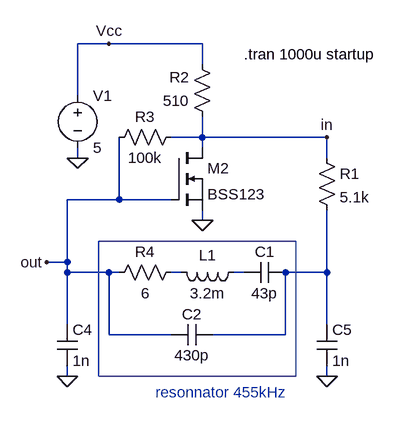
[diagram p0: schematic osc_LC2.asc]
osc_LC2.asc, the LTspice schematic file:
Version 4
SHEET 1 1732 684
WIRE 832 -320 784 -320
WIRE 976 -320 832 -320
WIRE 976 -288 976 -320
WIRE 784 -240 784 -320
WIRE 976 -176 976 -208
WIRE 976 -176 928 -176
WIRE 1168 -176 976 -176
WIRE 976 -160 976 -176
WIRE 784 -144 784 -160
WIRE 1168 -144 1168 -176
WIRE 848 -80 848 -176
WIRE 848 -80 768 -80
WIRE 928 -80 848 -80
WIRE 976 -48 976 -64
WIRE 768 16 768 -80
WIRE 768 16 736 16
WIRE 768 32 768 16
WIRE 832 32 768 32
WIRE 848 32 832 32
WIRE 944 32 928 32
WIRE 1040 32 1024 32
WIRE 1168 32 1168 -64
WIRE 1168 32 1104 32
WIRE 768 112 768 32
WIRE 1168 112 1168 32
WIRE 832 128 832 32
WIRE 928 128 832 128
WIRE 1104 128 1104 32
WIRE 1104 128 992 128
WIRE 768 192 768 176
WIRE 1168 192 1168 176
FLAG 736 16 out
FLAG 768 192 0
FLAG 1168 192 0
FLAG 1168 -176 in
FLAG 784 -144 0
FLAG 832 -320 Vcc
FLAG 976 -48 0
SYMBOL cap 752 112 R0
SYMATTR InstName C4
SYMATTR Value 1n
SYMBOL cap 1152 112 R0
SYMATTR InstName C5
SYMATTR Value 1n
SYMBOL res 992 -192 R180
WINDOW 0 36 76 Left 0
WINDOW 3 36 40 Left 0
SYMATTR InstName R2
SYMATTR Value 510
SYMBOL voltage 784 -256 R0
WINDOW 123 0 0 Left 0
WINDOW 39 0 0 Left 0
SYMATTR InstName V1
SYMATTR Value 5
SYMBOL nmos 928 -160 R0
SYMATTR InstName M2
SYMATTR Value BSS123
SYMBOL ind 1040 16 R90
WINDOW 0 5 56 VBottom 0
WINDOW 3 32 56 VTop 0
SYMATTR InstName L1
SYMATTR Value 3.2m
SYMBOL res 1152 -160 R0
SYMATTR InstName R1
SYMATTR Value 5.1k
SYMBOL cap 1104 16 R90
WINDOW 0 0 32 VBottom 0
WINDOW 3 32 32 VTop 0
SYMATTR InstName C1
SYMATTR Value 43p
SYMBOL res 944 -192 R90
WINDOW 0 0 56 VBottom 0
WINDOW 3 32 56 VTop 0
SYMATTR InstName R3
SYMATTR Value 100k
SYMBOL res 944 16 R90
WINDOW 0 0 56 VBottom 0
WINDOW 3 32 56 VTop 0
SYMATTR InstName R4
SYMATTR Value 6
SYMBOL cap 992 112 R90
WINDOW 0 0 32 VBottom 0
WINDOW 3 32 32 VTop 0
SYMATTR InstName C2
SYMATTR Value 430p
TEXT 1040 -304 Left 0 !.tran 1000u startup
TEXT 904 216 Left 0 ;resonnator 455kHz
RECTANGLE Normal 1120 192 816 -16

The netlist it stands for:
* osc_LC2.asc
C4 out 0 1n
C5 N003 0 1n
R2 in Vcc 510
V1 Vcc 0 5
M2 in out 0 0 BSS123
L1 N002 N001 3.2m
R1 in N003 5.1k
C1 N003 N002 43p
R3 in out 100k
R4 N001 out 6
C2 N003 out 430p
.model NMOS NMOS
.model PMOS PMOS
.lib standard.mos
.tran 1000u startup
* resonnator 455kHz
.backanno
.end